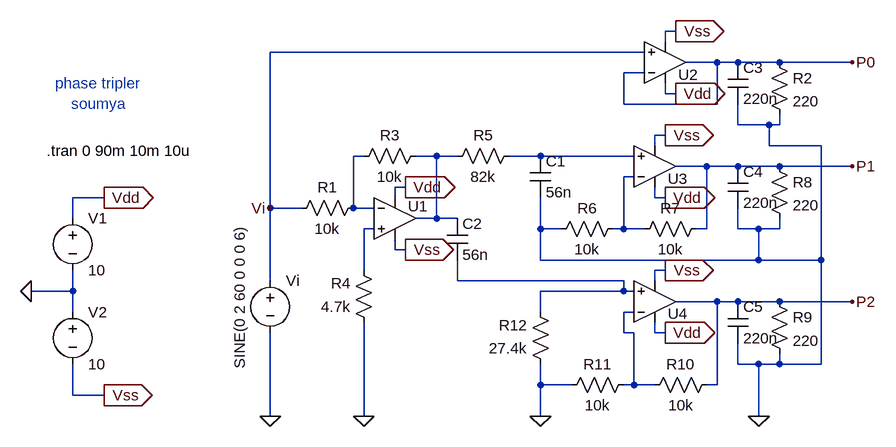
[diagram p0: schematic phase tripler.asc]
phase tripler.asc, the LTspice schematic file:
Version 4
SHEET 1 1256 680
WIRE 944 -256 928 -256
WIRE 928 -240 928 -256
WIRE 896 -224 320 -224
WIRE 1008 -208 960 -208
WIRE 1040 -208 1008 -208
WIRE 1104 -208 1040 -208
WIRE 1216 -208 1104 -208
WIRE 896 -192 864 -192
WIRE 928 -160 928 -176
WIRE 944 -160 928 -160
WIRE 864 -144 864 -192
WIRE 1008 -144 1008 -208
WIRE 1008 -144 864 -144
WIRE 1040 -112 1040 -144
WIRE 1088 -112 1040 -112
WIRE 1104 -112 1104 -128
WIRE 1104 -112 1088 -112
WIRE 928 -96 912 -96
WIRE 912 -80 912 -96
WIRE 1088 -80 1088 -112
WIRE 1168 -80 1088 -80
WIRE 464 -64 448 -64
WIRE 576 -64 544 -64
WIRE 608 -64 576 -64
WIRE 736 -64 688 -64
WIRE 880 -64 736 -64
WIRE 992 -48 944 -48
WIRE 1040 -48 992 -48
WIRE 1104 -48 1040 -48
WIRE 1216 -48 1104 -48
WIRE 880 -32 864 -32
WIRE 528 -16 512 -16
WIRE 64 0 16 0
WIRE 512 0 512 -16
WIRE 912 0 912 -16
WIRE 928 0 912 0
WIRE 320 16 320 -224
WIRE 368 16 320 16
WIRE 448 16 448 -64
WIRE 480 16 448 16
WIRE 16 32 16 0
WIRE 576 32 576 -64
WIRE 576 32 544 32
WIRE 608 32 576 32
WIRE 480 48 464 48
WIRE 736 48 736 0
WIRE 768 48 736 48
WIRE 864 48 864 -32
WIRE 864 48 848 48
WIRE 896 48 864 48
WIRE 992 48 992 -48
WIRE 992 48 976 48
WIRE 1040 48 1040 16
WIRE 1072 48 1040 48
WIRE 1104 48 1104 32
WIRE 1104 48 1072 48
WIRE 512 80 512 64
WIRE 528 80 512 80
WIRE 736 96 736 48
WIRE 1072 96 1072 48
WIRE 1072 96 736 96
WIRE 1168 96 1168 -80
WIRE 1168 96 1072 96
WIRE 464 112 464 48
WIRE 928 112 912 112
WIRE 320 128 320 16
WIRE 608 128 608 96
WIRE 864 128 608 128
WIRE 912 128 912 112
WIRE 16 144 16 112
WIRE 16 144 -48 144
WIRE 864 144 864 128
WIRE 864 144 736 144
WIRE 880 144 864 144
WIRE 1008 160 944 160
WIRE 1040 160 1008 160
WIRE 1104 160 1040 160
WIRE 1216 160 1104 160
WIRE 16 176 16 144
WIRE 736 176 736 144
WIRE 880 176 864 176
WIRE 864 208 864 176
WIRE 880 208 864 208
WIRE 912 208 912 192
WIRE 928 208 912 208
WIRE 1040 256 1040 224
WIRE 1072 256 1040 256
WIRE 1104 256 1104 240
WIRE 1104 256 1072 256
WIRE 1168 256 1168 96
WIRE 1168 256 1104 256
WIRE 736 288 736 256
WIRE 784 288 736 288
WIRE 880 288 880 208
WIRE 880 288 864 288
WIRE 912 288 880 288
WIRE 1008 288 1008 160
WIRE 1008 288 992 288
WIRE 16 304 16 256
WIRE 64 304 16 304
WIRE 320 336 320 208
WIRE 464 336 464 192
WIRE 736 336 736 288
WIRE 1072 336 1072 256
FLAG -48 144 0
FLAG 64 0 Vdd
IOPIN 64 0 Out
FLAG 64 304 Vss
IOPIN 64 304 Out
FLAG 528 -16 Vdd
IOPIN 528 -16 Out
FLAG 528 80 Vss
IOPIN 528 80 Out
FLAG 944 -160 Vdd
IOPIN 944 -160 Out
FLAG 944 -256 Vss
IOPIN 944 -256 Out
FLAG 928 0 Vdd
IOPIN 928 0 Out
FLAG 928 -96 Vss
IOPIN 928 -96 Out
FLAG 928 208 Vdd
IOPIN 928 208 Out
FLAG 928 112 Vss
IOPIN 928 112 Out
FLAG 736 336 0
FLAG 1072 336 0
FLAG 464 336 0
FLAG 1216 -208 P0
FLAG 1216 -48 P1
FLAG 1216 160 P2
FLAG 320 16 Vi
FLAG 320 336 0
SYMBOL voltage 16 16 R0
WINDOW 123 0 0 Left 0
WINDOW 39 0 0 Left 0
SYMATTR InstName V1
SYMATTR Value 10
SYMBOL voltage 16 160 R0
WINDOW 123 0 0 Left 0
WINDOW 39 0 0 Left 0
SYMATTR InstName V2
SYMATTR Value 10
SYMBOL OpAmps\\UniversalOpamp2 512 32 R0
WINDOW 0 20 -19 Left 2
SYMATTR InstName U1
SYMBOL res 464 0 R90
WINDOW 0 0 56 VBottom 2
WINDOW 3 32 56 VTop 2
SYMATTR InstName R1
SYMATTR Value 10k
SYMBOL OpAmps\\UniversalOpamp2 928 -208 M180
WINDOW 0 20 -19 Left 2
SYMATTR InstName U2
SYMBOL res 1088 -224 R0
SYMATTR InstName R2
SYMATTR Value 220
SYMBOL res 560 -80 R90
WINDOW 0 0 56 VBottom 2
WINDOW 3 32 56 VTop 2
SYMATTR InstName R3
SYMATTR Value 10k
SYMBOL res 480 208 R180
WINDOW 0 36 76 Left 2
WINDOW 3 36 40 Left 2
SYMATTR InstName R4
SYMATTR Value 4.7k
SYMBOL res 592 -48 R270
WINDOW 0 32 56 VTop 2
WINDOW 3 0 56 VBottom 2
SYMATTR InstName R5
SYMATTR Value 82k
SYMBOL cap 720 -64 R0
SYMATTR InstName C1
SYMATTR Value 56n
SYMBOL cap 592 32 R0
SYMATTR InstName C2
SYMATTR Value 56n
SYMBOL OpAmps\\UniversalOpamp2 912 -48 M180
WINDOW 0 20 -19 Left 2
SYMATTR InstName U3
SYMBOL res 864 32 R90
WINDOW 0 0 56 VBottom 2
WINDOW 3 32 56 VTop 2
SYMATTR InstName R6
SYMATTR Value 10k
SYMBOL res 992 32 R90
WINDOW 0 0 56 VBottom 2
WINDOW 3 32 56 VTop 2
SYMATTR InstName R7
SYMATTR Value 10k
SYMBOL OpAmps\\UniversalOpamp2 912 160 M180
WINDOW 0 20 -19 Left 2
SYMATTR InstName U4
SYMBOL cap 1024 -208 R0
SYMATTR InstName C3
SYMATTR Value 220n
SYMBOL cap 1024 -48 R0
SYMATTR InstName C4
SYMATTR Value 220n
SYMBOL res 1088 -64 R0
SYMATTR InstName R8
SYMATTR Value 220
SYMBOL res 1088 144 R0
SYMATTR InstName R9
SYMATTR Value 220
SYMBOL cap 1024 160 R0
SYMATTR InstName C5
SYMATTR Value 220n
SYMBOL res 1008 272 R90
WINDOW 0 0 56 VBottom 2
WINDOW 3 32 56 VTop 2
SYMATTR InstName R10
SYMATTR Value 10k
SYMBOL res 880 272 R90
WINDOW 0 0 56 VBottom 2
WINDOW 3 32 56 VTop 2
SYMATTR InstName R11
SYMATTR Value 10k
SYMBOL res 752 272 R180
WINDOW 0 36 76 Left 2
WINDOW 3 36 40 Left 2
SYMATTR InstName R12
SYMATTR Value 27.4k
SYMBOL voltage 320 112 R0
WINDOW 3 -47 152 VLeft 2
WINDOW 123 0 0 Left 0
WINDOW 39 0 0 Left 0
SYMATTR Value SINE(0 2 60 0 0 0 6)
SYMATTR InstName Vi
TEXT -24 -72 Left 2 !.tran 0 90m 10m 10u
TEXT 56 -160 Center 2 ;phase tripler\nsoumya

The netlist it stands for:
* phase tripler.asc
V1 Vdd 0 10
V2 0 Vss 10
XU1 N005 N001 Vdd Vss N002 level.2 Avol=1Meg GBW=10Meg Slew=10Meg ilimit=25m rail=0 Vos=0 phimargin=45 en=0 enk=0 in=0 ink=0 Rin=500Meg  ; pins IN+ IN- V+ V- OUT
R1 N001 Vi 10k
XU2 Vi P0 Vdd Vss P0 level.2 Avol=1Meg GBW=10Meg Slew=10Meg ilimit=25m rail=0 Vos=0 phimargin=45 en=0 enk=0 in=0 ink=0 Rin=500Meg  ; pins IN+ IN- V+ V- OUT
R2 P0 0 220
R3 N002 N001 10k
R4 0 N005 4.7k
R5 N002 N003 82k
C1 N003 0 56n
C2 N002 N006 56n
XU3 N003 N004 Vdd Vss P1 level.2 Avol=1Meg GBW=10Meg Slew=10Meg ilimit=25m rail=0 Vos=0 phimargin=45 en=0 enk=0 in=0 ink=0 Rin=500Meg  ; pins IN+ IN- V+ V- OUT
R6 N004 0 10k
R7 P1 N004 10k
XU4 N006 N007 Vdd Vss P2 level.2 Avol=1Meg GBW=10Meg Slew=10Meg ilimit=25m rail=0 Vos=0 phimargin=45 en=0 enk=0 in=0 ink=0 Rin=500Meg  ; pins IN+ IN- V+ V- OUT
C3 P0 0 220n
C4 P1 0 220n
R8 P1 0 220
R9 P2 0 220
C5 P2 0 220n
R10 P2 N007 10k
R11 N007 0 10k
R12 0 N006 27.4k
Vi Vi 0 SINE(0 2 60 0 0 0 6)
.tran 0 90m 10m 10u
* phase tripler
* soumya
.lib UniversalOpamps2.sub
.backanno
.end